# EAGLE schematic Kazzo (EAGLE 9.5.0)
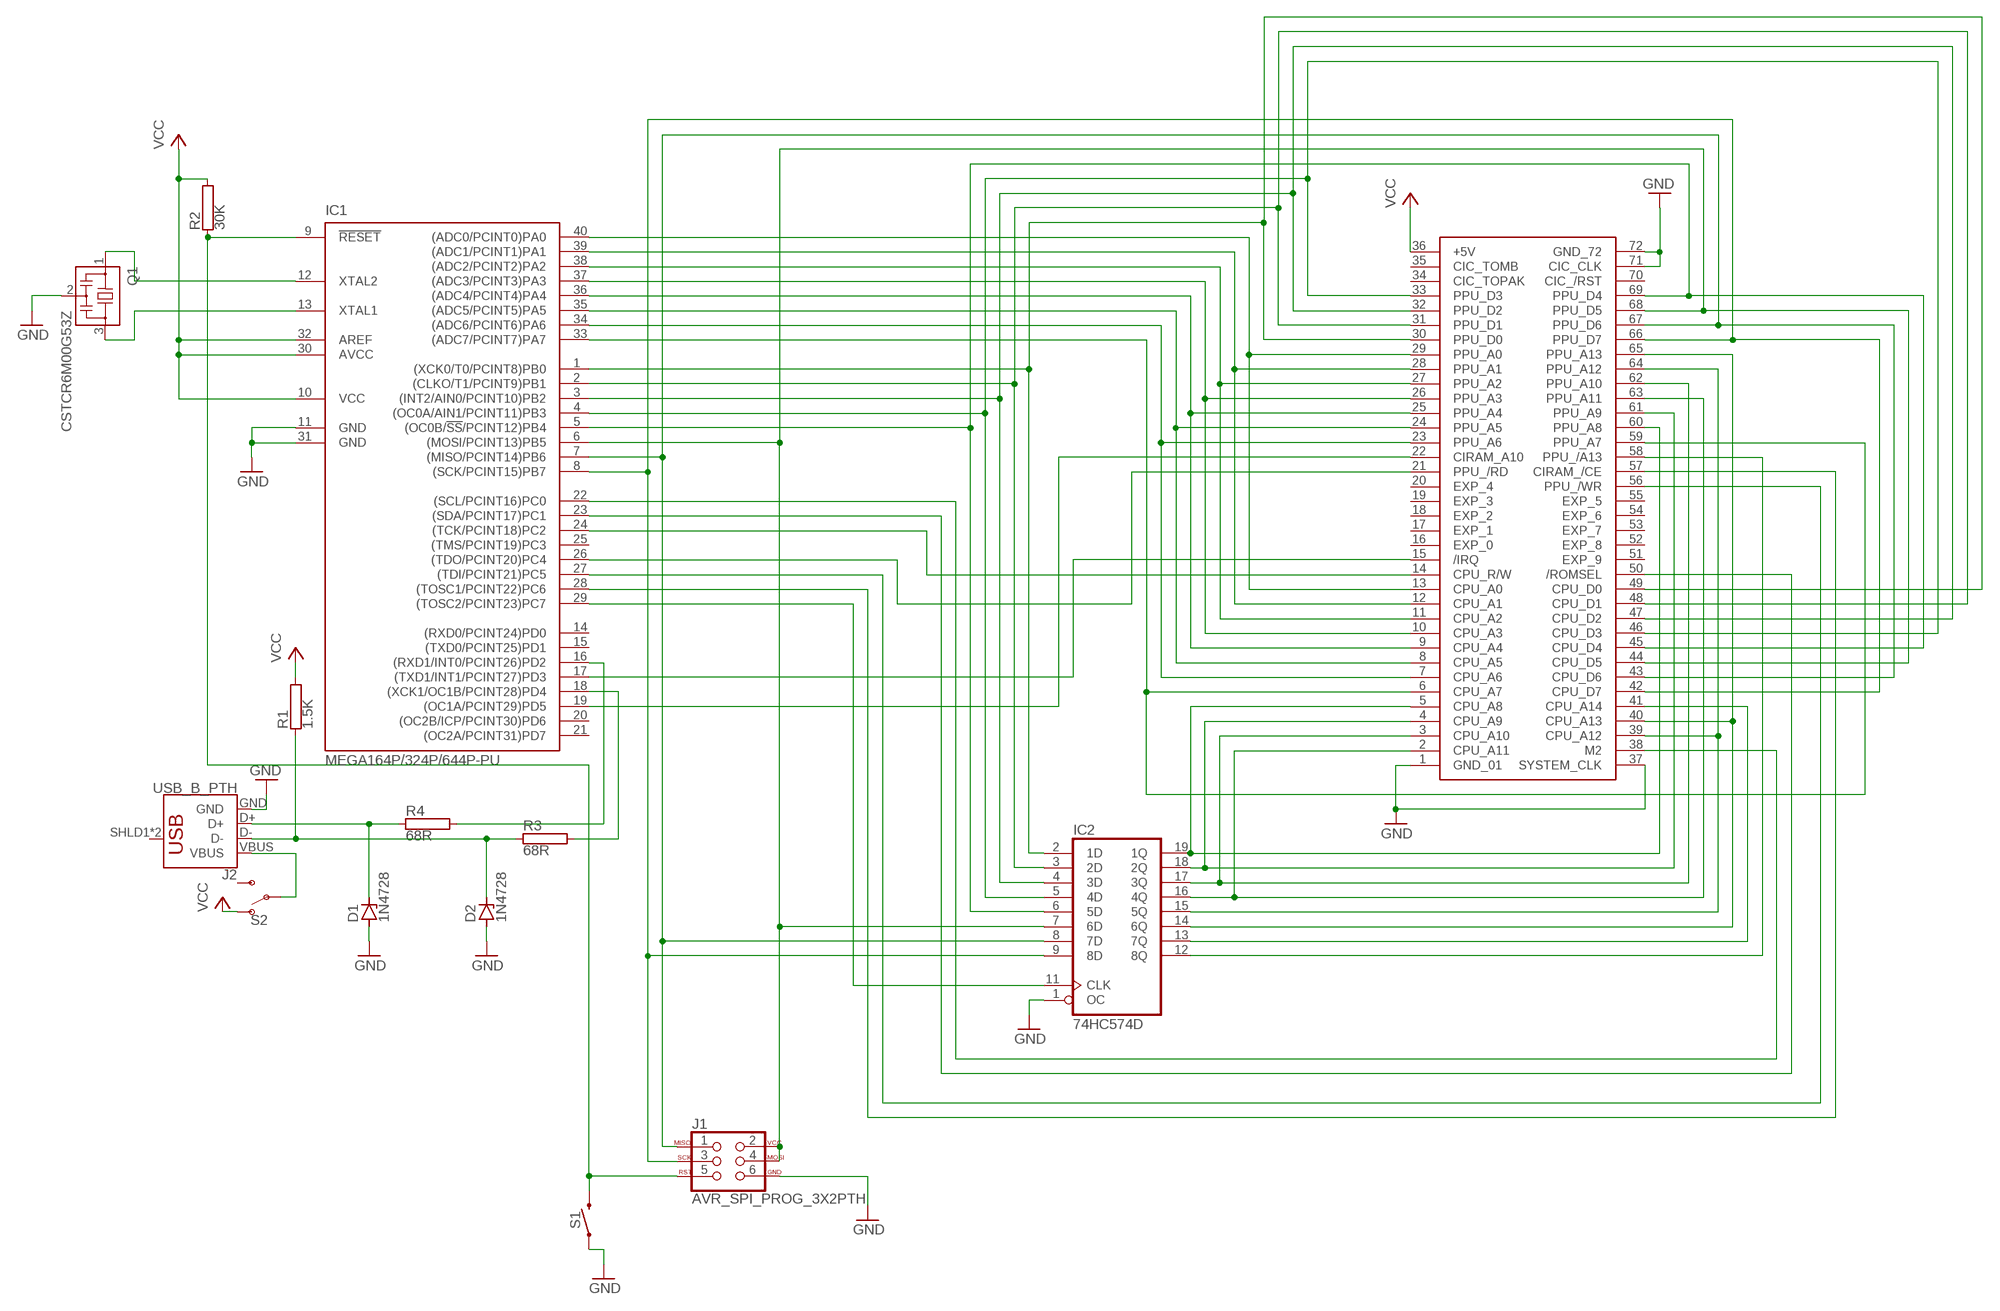
[diagram p0: schematic, sheet 1]

## Parts
D1  1N4728  [DO41Z10]
D2  1N4728  [DO41Z10]
IC1  MEGA164P/324P/644P-PU  [DIL40]
IC2  74HC574D  [SO20W]
IC3  NES_CONNECTOR  [NES_CONNECTOR]
J1  AVR_SPI_PROG_3X2PTH  [2X3]
J2  USB_B_PTH  [USB-B-PTH]
Q1  CSTCR6M00G53Z  [CSTCR6M]
R1  1.5K  RAC01  [AC01]
R2  30K  RAC01  [AC01]
R3  68R  RAC01  [AC01]
R4  68R  RAC01  [AC01]
S1  MOMENTARY-SWITCH-SPST-PTH-6.0MM-KIT  [TACTILE_SWITCH_PTH_6.0MM_KIT]
S2  SWITCH-SPDT-PTH-11.6X4.0MM  [SWITCH_SPDT_PTH_11.6X4.0MM]

## Nets
GND: D1.A D2.A IC1.11(GND) IC1.31(GND) IC2.1(OC) IC3.1(GND_01) IC3.37(SYSTEM_CLK) IC3.71(CIC_CLK) IC3.72(GND_72) J1.6 J2.GND Q1.2 S1.1
N$1: IC1.40((ADC0/PCINT0)PA0) IC3.13(CPU_A0) IC3.29(PPU_A0)
N$2: IC1.39((ADC1/PCINT1)PA1) IC3.12(CPU_A1) IC3.28(PPU_A1)
N$3: IC1.38((ADC2/PCINT2)PA2) IC3.11(CPU_A2) IC3.27(PPU_A2)
N$4: IC1.37((ADC3/PCINT3)PA3) IC3.10(CPU_A3) IC3.26(PPU_A3)
N$5: IC1.36((ADC4/PCINT4)PA4) IC3.9(CPU_A4) IC3.25(PPU_A4)
N$6: IC1.35((ADC5/PCINT5)PA5) IC3.8(CPU_A5) IC3.24(PPU_A5)
N$7: IC1.34((ADC6/PCINT6)PA6) IC3.7(CPU_A6) IC3.23(PPU_A6)
N$8: IC1.33((ADC7/PCINT7)PA7) IC3.6(CPU_A7) IC3.59(PPU_A7)
N$9: IC2.19(1Q) IC3.5(CPU_A8) IC3.60(PPU_A8)
N$10: IC2.18(2Q) IC3.4(CPU_A9) IC3.61(PPU_A9)
N$11: IC2.17(3Q) IC3.3(CPU_A10) IC3.62(PPU_A10)
N$12: IC2.16(4Q) IC3.2(CPU_A11) IC3.63(PPU_A11)
N$13: IC2.15(5Q) IC3.39(CPU_A12) IC3.64(PPU_A12)
N$14: IC2.14(6Q) IC3.40(CPU_A13) IC3.65(PPU_A13)
N$15: IC2.13(7Q) IC3.41(CPU_A14)
N$16: IC2.12(8Q) IC3.58(PPU_/A13)
N$17: IC1.1((XCK0/T0/PCINT8)PB0) IC2.2(1D) IC3.30(PPU_D0) IC3.49(CPU_D0)
N$18: IC1.2((CLKO/T1/PCINT9)PB1) IC2.3(2D) IC3.31(PPU_D1) IC3.48(CPU_D1)
N$19: IC1.3((INT2/AIN0/PCINT10)PB2) IC2.4(3D) IC3.32(PPU_D2) IC3.47(CPU_D2)
N$20: IC1.4((OC0A/AIN1/PCINT11)PB3) IC2.5(4D) IC3.33(PPU_D3) IC3.46(CPU_D3)
N$21: IC1.5((OC0B/!SS!/PCINT12)PB4) IC2.6(5D) IC3.45(CPU_D4) IC3.69(PPU_D4)
N$22: IC1.22((SCL/PCINT16)PC0) IC3.38(M2)
N$23: IC1.23((SDA/PCINT17)PC1) IC3.50(/ROMSEL)
N$24: IC1.24((TCK/PCINT18)PC2) IC3.14(CPU_R/W)
N$25: IC1.26((TDO/PCINT20)PC4) IC3.21(PPU_/RD)
N$26: IC1.27((TDI/PCINT21)PC5) IC3.56(PPU_/WR)
N$27: IC1.28((TOSC1/PCINT22)PC6) IC3.57(CIRAM_/CE)
N$28: IC1.29((TOSC2/PCINT23)PC7) IC2.11(CLK)
N$29: IC1.16((RXD1/INT0/PCINT26)PD2) R4.2
N$30: IC1.18((XCK1/OC1B/PCINT28)PD4) R3.2
N$31: IC1.6((MOSI/PCINT13)PB5) IC2.7(6D) IC3.44(CPU_D5) IC3.68(PPU_D5) J1.2 J1.4
N$32: IC1.7((MISO/PCINT14)PB6) IC2.8(7D) IC3.43(CPU_D6) IC3.67(PPU_D6) J1.1
N$33: IC1.8((SCK/PCINT15)PB7) IC2.9(8D) IC3.42(CPU_D7) IC3.66(PPU_D7) J1.3
N$34: IC1.9(!RESET) J1.5 R2.1 S1.3
N$35: D1.C J2.D+ R4.1
N$36: D2.C J2.D- R1.1 R3.1
N$37: J2.VBUS S2.2(P)
N$38: IC1.17((TXD1/INT1/PCINT27)PD3) IC3.15(/IRQ)
N$39: IC1.12(XTAL2) Q1.1
N$40: IC1.13(XTAL1) Q1.3
N$41: IC1.19((OC1A/PCINT29)PD5) IC3.22(CIRAM_A10)
VCC: IC1.10(VCC) IC1.30(AVCC) IC1.32(AREF) IC3.36(+5V) R1.2 R2.2 S2.1(O)
Unconnected: IC1.14((RXD0/PCINT24)PD0) IC1.15((TXD0/PCINT25)PD1) IC1.20((OC2B/ICP/PCINT30)PD6) IC1.21((OC2A/PCINT31)PD7) IC1.25((TMS/PCINT19)PC3) IC3.16(EXP_0) IC3.17(EXP_1) IC3.18(EXP_2) IC3.19(EXP_3) IC3.20(EXP_4) IC3.34(CIC_TOPAK) IC3.35(CIC_TOMB) IC3.51(EXP_9) IC3.52(EXP_8) IC3.53(EXP_7) IC3.54(EXP_6) IC3.55(EXP_5) IC3.70(CIC_/RST) J2.SHLD1(SHIELD) J2.SHLD2(SHIELD) S2.3(S)

## Power pins joined to a net without a drawn wire
GND: IC2.10(GND)
VCC: IC2.20(VCC)

## Library data of the parts
D1 D2 = diode:1N4728: Z DIODE 3.3 V, 1W, 5 percent
IC1 = avr-7:MEGA164P/324P/644P-PU
IC2 = 74xx-eu:74*574: 8-bit D type FLIP FLOP bus driver
IC3 = mylibrary:NES_CONNECTOR
J1 = SparkFun-Connectors:AVR_SPI_PROG_3X2: AVR ISP 6 Pin This is the reduced ISP connector for AVR programming. Common on Arduino. This footprint will take up less PCB space and can be used with a 10-pin to 6-pin adapter such as SKU: BOB-08508 **Special note about "TEST_POINT" package. The stop mask is on the top side, so if you want your programming test points to be on the bottom of your board, make sure to place this package on the bottom side of the board. This also ensure that the orientation to program from the bottom side will be correct. SparkFun Products: SparkFun ISP Pogo Adapter <https://www.sparkfun.com/products/11591> - NS Tiny AVR Programmer <https://www.sparkfun.com/products/11801> -PTH
J2 = SparkFun-Connectors:USB_B: USB Type B Connector SparkFun Products: SparkFun Stepoko <https://www.sparkfun.com/products/13899> PTH; PROD_ID: CONN-08278; SF_ID: PRT-00139
Q1 = murata-filter:CSTCR: Resonator Source: murata.co.jp; MPN: CSTCR6M00G53-R0; OC_FARNELL: 1170434; OC_NEWARK: 25M8759
R1-R4 = resistor-power:R: Power Resitor; OC_FARNELL: unknown; OC_NEWARK: unknown
S1 = SparkFun-Switches:MOMENTARY-SWITCH-SPST: Momentary Switch (Pushbutton) - SPST Normally-open (NO) SPST momentary switches (buttons, pushbuttons). Variants PTH-12MM - 12mm square, through-hole Momentary Pushbutton Switch - 12mm Square <https://www.sparkfun.com/products/9190> (COM-09190) PTH-6.0MM, PTH-6.0MM-KIT - 6.0mm square, through-hole Mini Pushbutton Switch <https://www.sparkfun.com/products/97> (COM-00097) KIT package intended for soldering kit's - only one side of pads' copper is exposed. PTH-RIGHT-ANGLE-KIT - Right-angle, through-hole Right Angle Tactile Button <https://www.sparkfun.com/products/10791> - Used on SparkFun BigTime Watch Kit <https://www.sparkfun.com/products/11734> SMD-12MM - 12mm square, surface-mount Tactile Button - SMD (12mm) <https://www.sparkfun.com/products/12993> (COM-12993) Used on SparkFun PicoBoard <https://www.sparkfun.com/products/11888> SMD-4.5MM - 4.5mm Square Trackball Switch Used on SparkFun Blackberry Trackballer Breakout <https://www.sparkfun.com/products/13169> SMD-4.6MMX2.8MM - 4.60mm x 2.80mm, surface mount Used on SparkFun SAMD21 Mini Breakout <https://www.sparkfun.com/products/13664> SMD-5.2MM, SMD-5.2-REDUNDANT - 5.2mm square, surface-mount Mini Pushbutton Switch - SMD <https://www.sparkfun.com/products/8720> (COM-08720) Used on Arduino Pro Mini <https://www.sparkfun.com/products/11114> REDUNDANT package connects both switch circuits together SMD-6.0X3.5MM - 6.0 x 3.5mm, surface mount Momentary Reset Switch SMD <https://www.sparkfun.com/products/8229> (COM-08229) SMD-6.2MM-TALL - 6.2mm square, surface mount Tactile Button - SMD (6mm) <https://www.sparkfun.com/products/12992> Used on SparkFun Digital Sandbox <https://www.sparkfun.com/products/12651> SMD-RIGHT-ANGLE - Right-angle, surface mount Used on SparkFun Block for Intel® Edison - Arduino <https://www.sparkfun.com/products/13036>; PROD_ID: SWCH-08441; SF_SKU: COM-00097
S2 = SparkFun-Switches:SWITCH-SPDT: Single Pole, Double Throw (SPDT) Switch Single-pole, double-throw (SPDT) switch. Variant Overview SMD-AYZ0202 Surface Mount DPDT Switch <https://www.sparkfun.com/products/597> (COM-00597) Used on e.g. LilyPad Arduino USB - ATmega32U4 Board <https://www.sparkfun.com/products/12049> PTH-11.6X4.0MM SPDT Mini Power Switch <https://www.sparkfun.com/products/102> (COM-00102) Used on e.g. SparkFun Simon Says - Through-Hole Soldering Kit <https://www.sparkfun.com/products/10547> (KIT-10547) PTH-11.6X4.0MM-KIT KIT version of SPDT Mini Power Switch - Simplifies soldering by removing tStop of switch pins - only one side can be soldered. PTH-11.6X4.0MM-LOCK LOCK version of SPDT Mini Power Switch - Offset pins hold switch in place for easier soldering. SMD-RIGHT-ANGLE Surface Mount Right Angle Switch <https://www.sparkfun.com/products/10860> (COM-10860) Used on e.g. SparkFun ESP8266 Thing <https://www.sparkfun.com/products/13231>; PROD_ID: SWCH-08261; SF_SKU: COM-00102